# Altium schematic sheet Sensors.SchDoc
size A3
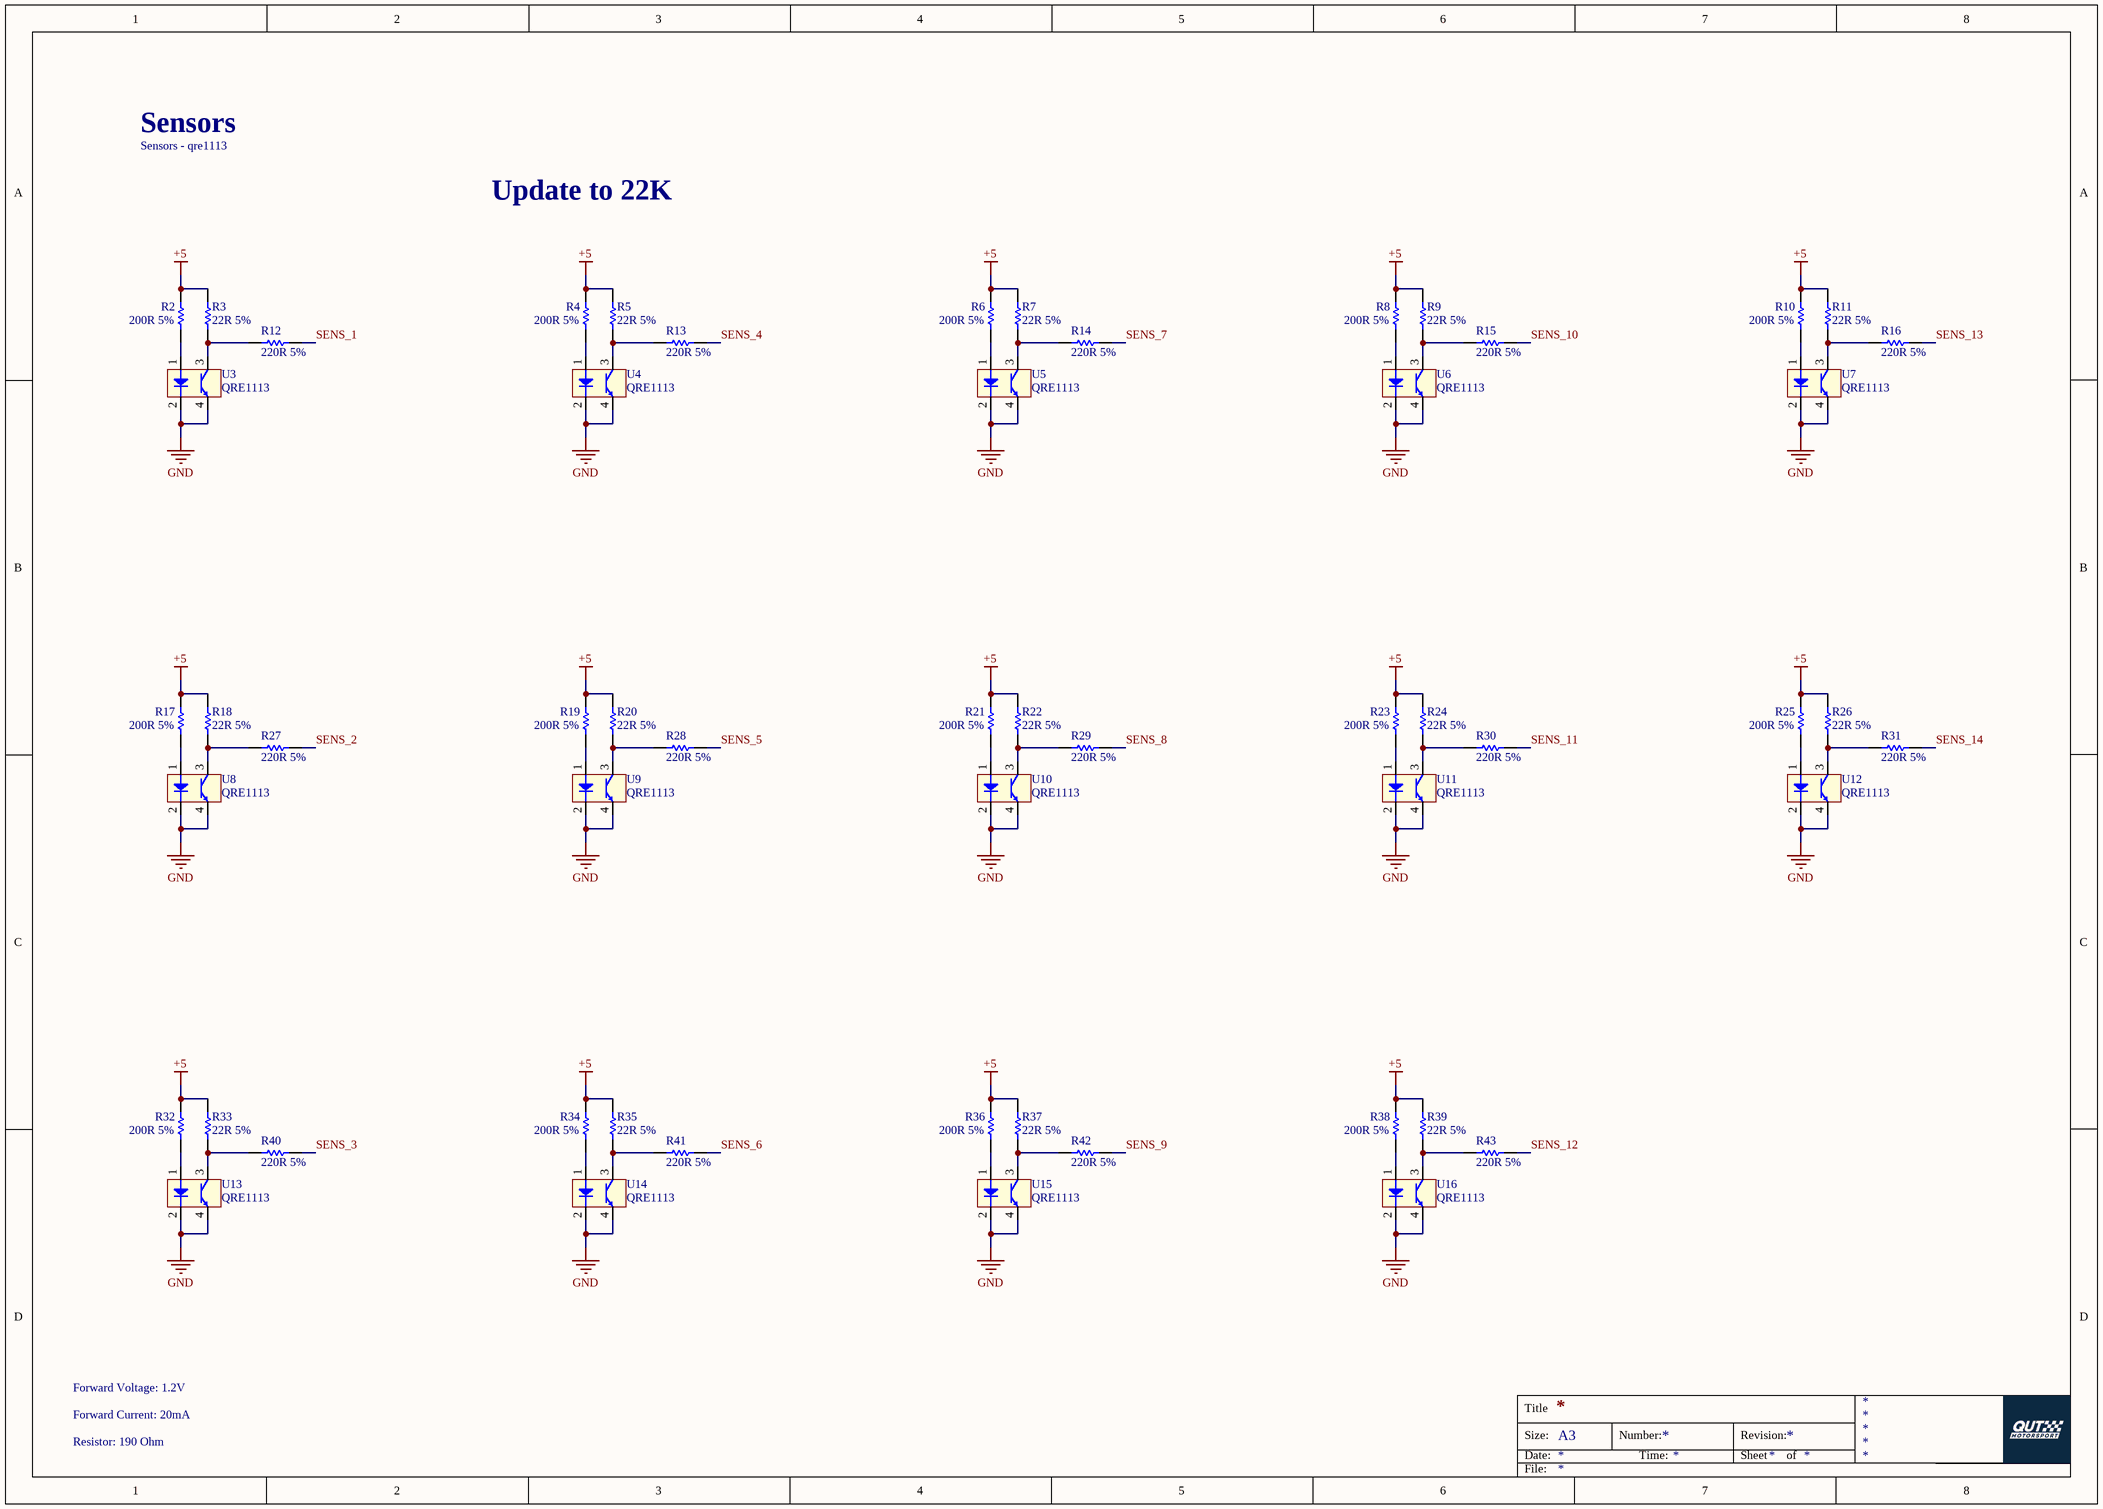
[diagram p0: Sensors.SchDoc]

## Parts
R2  200R 5%  [RESC0603(1608)_L]
R3  22R 5%  [RESC0603(1608)_N]
R4  200R 5%  [RESC0603(1608)_L]
R5  22R 5%  [RESC0603(1608)_N]
R6  200R 5%  [RESC0603(1608)_L]
R7  22R 5%  [RESC0603(1608)_N]
R8  200R 5%  [RESC0603(1608)_L]
R9  22R 5%  [RESC0603(1608)_N]
R10  200R 5%  [RESC0603(1608)_L]
R11  22R 5%  [RESC0603(1608)_N]
R12  220R 5%  [RESC0603(1608)_M]
R13  220R 5%  [RESC0603(1608)_M]
R14  220R 5%  [RESC0603(1608)_M]
R15  220R 5%  [RESC0603(1608)_M]
R16  220R 5%  [RESC0603(1608)_M]
R17  200R 5%  [RESC0603(1608)_L]
R18  22R 5%  [RESC0603(1608)_N]
R19  200R 5%  [RESC0603(1608)_L]
R20  22R 5%  [RESC0603(1608)_N]
R21  200R 5%  [RESC0603(1608)_L]
R22  22R 5%  [RESC0603(1608)_N]
R23  200R 5%  [RESC0603(1608)_L]
R24  22R 5%  [RESC0603(1608)_N]
R25  200R 5%  [RESC0603(1608)_L]
R26  22R 5%  [RESC0603(1608)_N]
R27  220R 5%  [RESC0603(1608)_M]
R28  220R 5%  [RESC0603(1608)_M]
R29  220R 5%  [RESC0603(1608)_M]
R30  220R 5%  [RESC0603(1608)_M]
R31  220R 5%  [RESC0603(1608)_M]
R32  200R 5%  [RESC0603(1608)_L]
R33  22R 5%  [RESC0603(1608)_N]
R34  200R 5%  [RESC0603(1608)_L]
R35  22R 5%  [RESC0603(1608)_N]
R36  200R 5%  [RESC0603(1608)_L]
R37  22R 5%  [RESC0603(1608)_N]
R38  200R 5%  [RESC0603(1608)_L]
R39  22R 5%  [RESC0603(1608)_N]
R40  220R 5%  [RESC0603(1608)_M]
R41  220R 5%  [RESC0603(1608)_M]
R42  220R 5%  [RESC0603(1608)_M]
R43  220R 5%  [RESC0603(1608)_M]
U3  QRE1113  [QRE1113GR]
U4  QRE1113  [QRE1113GR]
U5  QRE1113  [QRE1113GR]
U6  QRE1113  [QRE1113GR]
U7  QRE1113  [QRE1113GR]
U8  QRE1113  [QRE1113GR]
U9  QRE1113  [QRE1113GR]
U10  QRE1113  [QRE1113GR]
U11  QRE1113  [QRE1113GR]
U12  QRE1113  [QRE1113GR]
U13  QRE1113  [QRE1113GR]
U14  QRE1113  [QRE1113GR]
U15  QRE1113  [QRE1113GR]
U16  QRE1113  [QRE1113GR]

## Nets
+5: R2.2 R3.2 R4.2 R5.2 R6.2 R7.2 R8.2 R9.2 R10.2 R11.2 R17.2 R18.2 R19.2 R20.2 R21.2 R22.2 R23.2 R24.2 R25.2 R26.2 R32.2 R33.2 R34.2 R35.2 R36.2 R37.2 R38.2 R39.2
GND: U3.2 U3.4 U4.2 U4.4 U5.2 U5.4 U6.2 U6.4 U7.2 U7.4 U8.2 U8.4 U9.2 U9.4 U10.2 U10.4 U11.2 U11.4 U12.2 U12.4 U13.2 U13.4 U14.2 U14.4 U15.2 U15.4 U16.2 U16.4
SENS_1: R12.2
SENS_2: R27.2
SENS_3: R40.2
SENS_4: R13.2
SENS_5: R28.2
SENS_6: R41.2
SENS_7: R14.2
SENS_8: R29.2
SENS_9: R42.2
SENS_10: R15.2
SENS_11: R30.2
SENS_12: R43.2
SENS_13: R16.2
SENS_14: R31.2
NetR2_1: R2.1 U3.1
NetR3_1: R3.1 R12.1 U3.3
NetR4_1: R4.1 U4.1
NetR5_1: R5.1 R13.1 U4.3
NetR6_1: R6.1 U5.1
NetR7_1: R7.1 R14.1 U5.3
NetR8_1: R8.1 U6.1
NetR9_1: R9.1 R15.1 U6.3
NetR10_1: R10.1 U7.1
NetR11_1: R11.1 R16.1 U7.3
NetR17_1: R17.1 U8.1
NetR18_1: R18.1 R27.1 U8.3
NetR19_1: R19.1 U9.1
NetR20_1: R20.1 R28.1 U9.3
NetR21_1: R21.1 U10.1
NetR22_1: R22.1 R29.1 U10.3
NetR23_1: R23.1 U11.1
NetR24_1: R24.1 R30.1 U11.3
NetR25_1: R25.1 U12.1
NetR26_1: R26.1 R31.1 U12.3
NetR32_1: R32.1 U13.1
NetR33_1: R33.1 R40.1 U13.3
NetR34_1: R34.1 U14.1
NetR35_1: R35.1 R41.1 U14.3
NetR36_1: R36.1 U15.1
NetR37_1: R37.1 R42.1 U15.3
NetR38_1: R38.1 U16.1
NetR39_1: R39.1 R43.1 U16.3

## Notes on the sheet
- Sensors - qre1113
- Sensors
- Update to 22K
- Forward Voltage: 1.2V
- Forward Current: 20mA
- Resistor: 190 Ohm
- Title
- Size:
- Date:
- A3
- Number:
- Time:
- Revision:
- Sheet
- of
- File:

## Library data of the parts
R2 R4 R6 R8 R10 R17 R19 R21 R23 R25 R32 R34 R36 R38 = CMP-1012-00057-1: 200R 0.1W 5% 0603 (1608 Metric)  SMD; Case-EIA: 0603; Case-Metric: 1608; Value: 200.00 Ohm; Technology: SMT; Tolerance: 5 %; Power: 0.1 W
R3 R5 R7 R9 R11 R18 R20 R22 R24 R26 R33 R35 R37 R39 = CMP-1012-00034-1: 22R 0.1W 5% 0603 (1608 Metric)  SMD; Value: 22.00 Ohm; Case-EIA: 0603; Case-Metric: 1608; Technology: SMT; Power: 0.1 W; Tolerance: 5 %
R12-R16 R27-R31 R40-R43 = CMP-1012-00058-1: 220R 0.1W 5% 0603 (1608 Metric)  SMD; Case-EIA: 0603; Case-Metric: 1608; Value: 220.00 Ohm; Technology: SMT; Power: 0.1 W; Tolerance: 5 %